# Altium schematic sheet 4_PushButtons.SchDoc
size A4; SheetNumber: 4; SheetTotal: 5
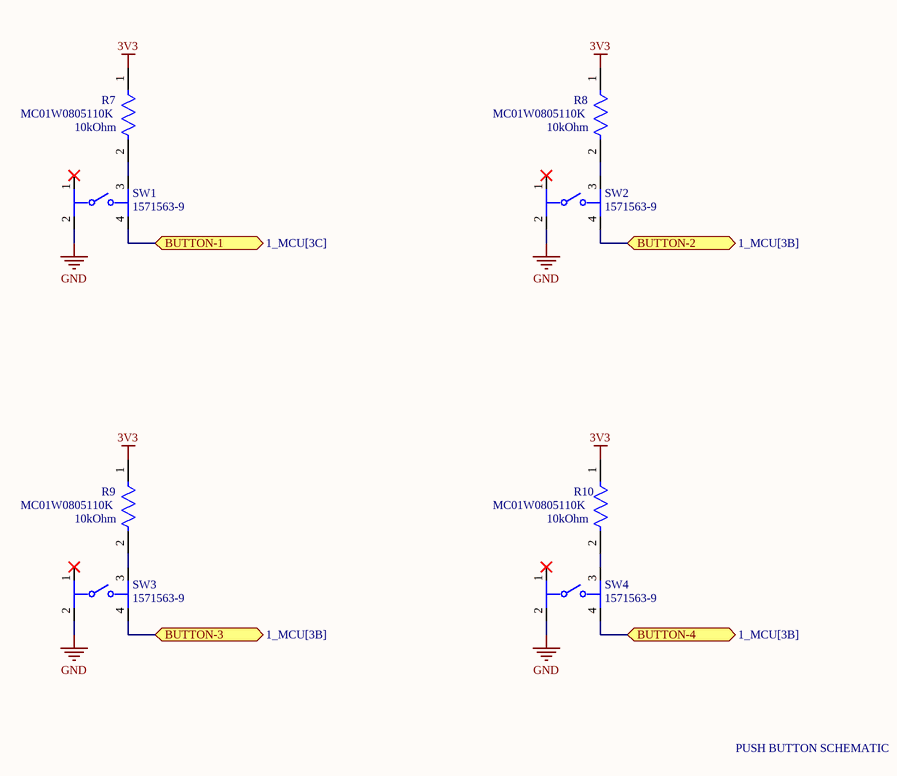
[diagram p0: 4_PushButtons.SchDoc]

## Parts
R7  MC01W0805110K  [FP-MC01W0805-IPC_C]
R8  MC01W0805110K  [FP-MC01W0805-IPC_C]
R9  MC01W0805110K  [FP-MC01W0805-IPC_C]
R10  MC01W0805110K  [FP-MC01W0805-IPC_C]
SW1  1571563-9  [FP-1571563-9-MFG]
SW2  1571563-9  [FP-1571563-9-MFG]
SW3  1571563-9  [FP-1571563-9-MFG]
SW4  1571563-9  [FP-1571563-9-MFG]

## Ports
BUTTON-1 (bidir, see 1_MCU[3C]), BUTTON-2 (bidir, see 1_MCU[3B]), BUTTON-3 (bidir, see 1_MCU[3B]), BUTTON-4 (bidir, see 1_MCU[3B])

## Nets
3V3: R7.1 R8.1 R9.1 R10.1
GND: SW1.2 SW2.2 SW3.2 SW4.2
BUTTON-1: SW1.4 ; port BUTTON-1
BUTTON-2: SW2.4 ; port BUTTON-2
BUTTON-3: SW3.4 ; port BUTTON-3
BUTTON-4: SW4.4 ; port BUTTON-4
NetR7_2: R7.2 SW1.3
NetR8_2: R8.2 SW2.3
NetR9_2: R9.2 SW3.3
NetR10_2: R10.2 SW4.3

Not connected (* = marked no-connect by the designer): SW1 1*; SW2 1*; SW3 1*; SW4 1*

## Notes on the sheet
- (near R7) 10kOhm
- (near R8) 10kOhm
- (near R9) 10kOhm
- (near R10) 10kOhm
- PUSH BUTTON SCHEMATIC

## Library data of the parts
R7-R10 = CMP-12256-000003-1: Resistor, 10K, 0.1W, 1%, 0805, Reel; Resistance: 10kR; Voltage Rating: 150V; Temperature Coefficient: 100ppm/°C; Power Rating: 100mW; REACH SVHC: No SVHC; Composition: Thick Film; Max Operating Temperature: 155°C; Case/Package: 0805; Tolerance: 1%; Number of Pins: 2; Case Code (Metric): 2012; Voltage Rating (DC): 150V; Min Operating Temperature: -55°C; Width: 1.25mm; Case Code (Imperial): 0805; Packaging: Cut Tape
SW1-SW4 = CMP-03402-000005-1: SWITCH TACTILE SPST-NO 0.05A 24V; Manufacturer: TE Connectivity; Standoff Height: 0.05mm; Electromechanical Life: 100000Cycles; Contact Resistance: 100mΩ; Operating Force: 160gf; Contact Current Rating: 50mA; Automotive: No; Device Class L1: Electromechanical; Voltage Rating Dc: 24V; ComponentLink2Description: Datasheet; Mount: Surface Mount; RoHS: TRUE; Temperature: -35°C to +85°C; ComponentLink2URL: https://www.te.com/commerce/DocumentDelivery/DDEController?Action=showdoc&DocId=Customer+Drawing%7F2-1437565-7%7FV%7Fpdf%7FEnglish%7FENG_CD_2-1437565-7_V.pdf%7F1571563-9; Manufacturer Part Number: 1571563-9; Temperature Range Low: -35°C; Lead Free: Yes; Device Class L2: Switches; Package: SMT_SW_6MM0_6MM0; Octopart: https://octopart.com/1571563-9-te+connectivity-41253969; Throw Configuration: SPST-NO; Mouser Description: Tactile Switches SPST OFF(ON) RND SMT MINI PB TACT SWITCH; Temperature Range High: +85°C; Digikey Description: SWITCH TACTILE SPST-NO 0.05A 24V; Device Class L3: Pushbutton Switches; Category: Switch; Height: 9.75mm